# EAGLE schematic intput-selector (EAGLE 6.4)
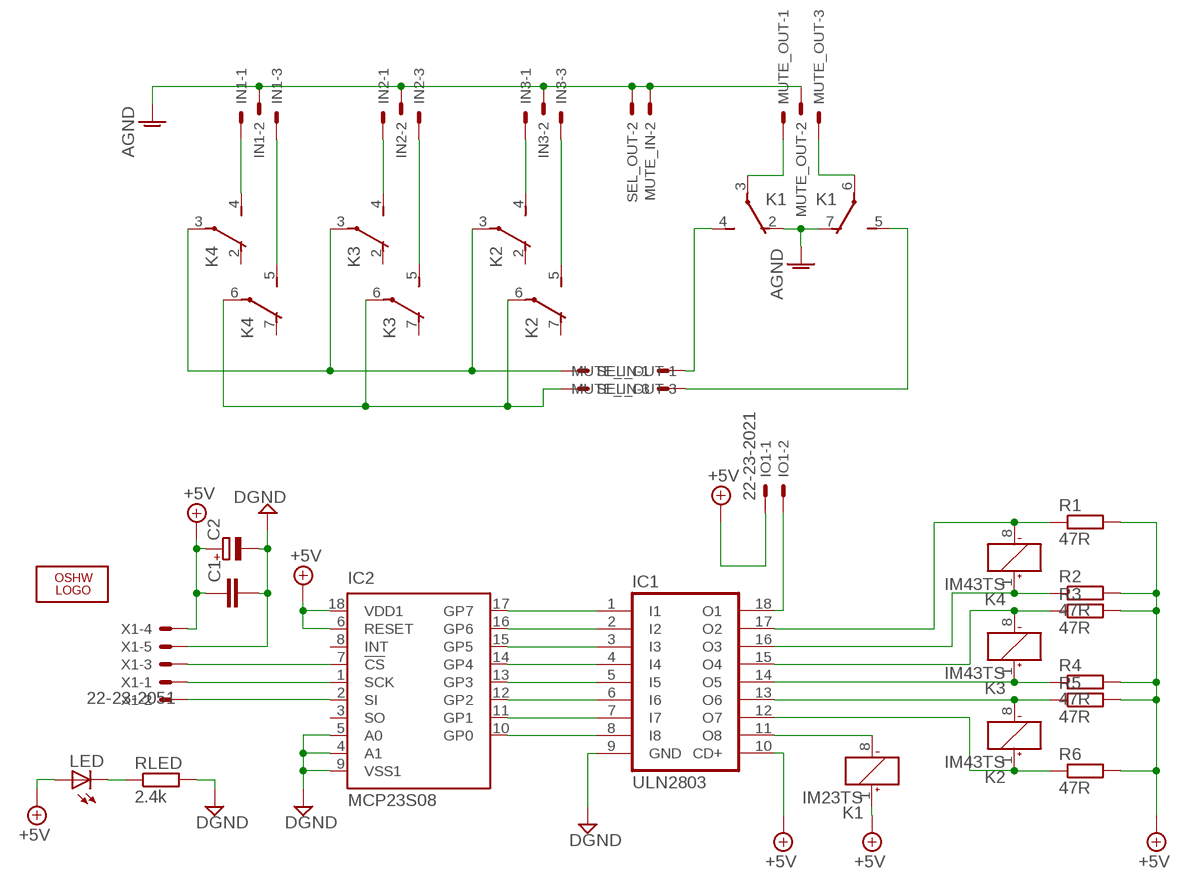
[diagram p0: schematic, sheet 1]

## Parts
C1  C-EUC1206  [C1206]
C2  CPOL-EUC  [PANASONIC_C]
IC1  ULN2803  ULN2803ADW  [SO-18W]
IC2  MCP23S08  MCP23S08-E/SO  [SO-18W]
IN1  22-23-2031  [22-23-2031]
IN2  22-23-2031  [22-23-2031]
IN3  22-23-2031  [22-23-2031]
IO1  22-23-2021  [22-23-2021]
K1  IM23TS  [IM43TS]
K2  IM43TS  [IM43TS]
K3  IM43TS  [IM43TS]
K4  IM43TS  [IM43TS]
LED  LEDCHIPLED_1206  [CHIPLED_1206]
LOGO1  OSHW_LOGO_FILLX0200-NT  [OSHW_FILLX200_NOTEXT]
MUTE_IN  22-23-2031  [22-23-2031]
MUTE_OUT  22-23-2031  [22-23-2031]
R1  47R  R-EU_R1206  [R1206]
R2  47R  R-EU_R1206  [R1206]
R3  47R  R-EU_R1206  [R1206]
R4  47R  R-EU_R1206  [R1206]
R5  47R  R-EU_R1206  [R1206]
R6  47R  R-EU_R1206  [R1206]
RLED  2.4k  R-EU_R1206  [R1206]
SEL_OUT  22-23-2031  [22-23-2031]
X1  22-23-2051  [22-23-2051]

## Nets
+5V: C1.1 C2.+ IC1.10(CD+) IC2.6(RESET) IC2.18(VDD1) IO1.1 K1.1(1:+) LED.A R1.2 R2.2 R3.2 R4.2 R5.2 R6.2 X1.4
AGND: IN1.2 IN2.2 IN3.2 K1.2(2:O) K1.7(3:O) MUTE_IN.2 MUTE_OUT.2 SEL_OUT.2
CS: IC2.7(!CS) X1.3
DGND: C1.2 C2.- IC1.9(GND) IC2.4(A1) IC2.5(A0) IC2.9(VSS1) RLED.2 X1.5
INL: K2.3(2:P) K3.3(2:P) K4.3(2:P) SEL_OUT.1
INR: K2.6(3:P) K3.6(3:P) K4.6(3:P) SEL_OUT.3
N$1: IC1.1(I1) IC2.17(GP7)
N$2: IC1.2(I2) IC2.16(GP6)
N$3: IC1.3(I3) IC2.15(GP5)
N$4: IC1.5(I5) IC2.13(GP3)
N$5: IC1.6(I6) IC2.12(GP2)
N$6: IC1.7(I7) IC2.11(GP1)
N$7: IC1.4(I4) IC2.14(GP4)
N$8: IC1.8(I8) IC2.10(GP0)
N$9: IC1.16(O3) K4.1(1:+) R2.1
N$10: IC1.14(O5) K3.1(1:+) R4.1
N$11: IC1.13(O6) K2.8(1:-) R5.1
N$12: IC1.12(O7) K2.1(1:+) R6.1
N$13: IC1.15(O4) K3.8(1:-) R3.1
N$14: IC1.11(O8) K1.8(1:-)
N$15: IC1.17(O2) K4.8(1:-) R1.1
N$16: IC1.18(O1) IO1.2
N$17: K1.6(3:P) MUTE_OUT.3
N$18: K1.3(2:P) MUTE_OUT.1
N$31: IN1.1 K4.4(2:S)
N$32: IN1.3 K4.5(3:S)
N$33: IN2.1 K3.4(2:S)
N$34: IN2.3 K3.5(3:S)
N$35: IN3.1 K2.4(2:S)
N$36: IN3.3 K2.5(3:S)
N$67: LED.C RLED.1
OUTL: K1.4(2:S) MUTE_IN.1
OUTR: K1.5(3:S) MUTE_IN.3
SCK: IC2.1(SCK) X1.1
SI: IC2.2(SI) X1.2
Unconnected: IC2.3(SO) IC2.8(INT) K2.2(2:O) K2.7(3:O) K3.2(2:O) K3.7(3:O) K4.2(2:O) K4.7(3:O)

## Library data of the parts
C1 = rcl:C-EU: CAPACITOR, European symbol
C2 = rcl:CPOL-EU: POLARIZED CAPACITOR, European symbol
IC1 = uln-udn-mine:ULN2803ADW
IC2 = microchip-mine:MCP23S08-E/SO
IN1-IN3 MUTE_IN MUTE_OUT SEL_OUT = con-molex:22-23-2031: .100" (2.54mm) Center Header - 3 Pin; MF: MOLEX; MPN: 22-23-2031; OC_FARNELL: 1462950; OC_NEWARK: 30C0862
IO1 = con-molex:22-23-2021: .100" (2.54mm) Center Header - 2 Pin; MF: MOLEX; MPN: 22-23-2021; OC_FARNELL: 1462926; OC_NEWARK: 25C3832
K1-K4 = relay-te:IM
LED = led:LED: LED OSRAM: - CHIPLED LG R971, LG N971, LY N971, LG Q971, LY Q971, LO R971, LY R971 LH N974, LH R974 LS Q976, LO Q976, LY Q976 LO Q996 - Hyper CHIPLED LW Q18S LB Q993, LB Q99A, LB R99A - SideLED LS A670, LO A670, LY A670, LG A670, LP A670 LB A673, LV A673, LT A673, LW A673 LH A674 LY A675 LS A676, LA A676, LO A676, LY A676, LW A676 LS A679, LY A679, LG A679 - Hyper Micro SIDELED® LS Y876, LA Y876, LO Y876, LY Y876 LT Y87S - SmartLED LW L88C, LW L88S LB L89C, LB L89S, LG L890 LS L89K, LO L89K, LY L89K LS L896, LA L896, LO L896, LY L896 - TOPLED LS T670, LO T670, LY T670, LG T670, LP T670 LSG T670, LSP T670, LSY T670, LOP T670, LYG T670 LG T671, LOG T671, LSG T671 LB T673, LV T673, LT T673, LW T673 LH T674 LS T676, LA T676, LO T676, LY T676, LB T676, LH T676, LSB T676, LW T676 LB T67C, LV T67C, LT T67C, LS T67K, LO T67K, LY T67K, LW E67C LS E67B, LA E67B, LO E67B, LY E67B, LB E67C, LV E67C, LT E67C LW T67C LS T679, LY T679, LG T679 LS T770, LO T770, LY T770, LG T770, LP T770 LB T773, LV T773, LT T773, LW T773 LH T774 LS E675, LA E675, LY E675, LS T675 LS T776, LA T776, LO T776, LY T776, LB T776 LHGB T686 LT T68C, LB T68C - Hyper Mini TOPLED® LB M676 - Mini TOPLED Santana® LG M470 LS M47K, LO M47K, LY M47K Source: http://www.osram.convergy.de LUXEON: - LUMILED® LXK2-PW12-R00, LXK2-PW12-S00, LXK2-PW14-U00, LXK2-PW14-V00 LXK2-PM12-R00, LXK2-PM12-S00, LXK2-PM14-U00 LXK2-PE12-Q00, LXK2-PE12-R00, LXK2-PE12-S00, LXK2-PE14-T00, LXK2-PE14-U00 LXK2-PB12-K00, LXK2-PB12-L00, LXK2-PB12-M00, LXK2-PB14-N00, LXK2-PB14-P00, LXK2-PB14-Q00 LXK2-PR12-L00, LXK2-PR12-M00, LXK2-PR14-Q00, LXK2-PR14-R00 LXK2-PD12-Q00, LXK2-PD12-R00, LXK2-PD12-S00 LXK2-PH12-R00, LXK2-PH12-S00 LXK2-PL12-P00, LXK2-PL12-Q00, LXK2-PL12-R00 Source: www.luxeon.com KINGBRIGHT: KA-3528ASYC Source: www.kingbright.com
LOGO1 = ohw-logo:OSHW_LOGO_FILL
R1-R6 RLED = rcl:R-EU_: RESISTOR, European symbol
X1 = con-molex:22-23-2051: .100" (2.54mm) Center Header - 5 Pin; MF: MOLEX; MPN: 22-23-2051; OC_FARNELL: 1462952; OC_NEWARK: 38C9178